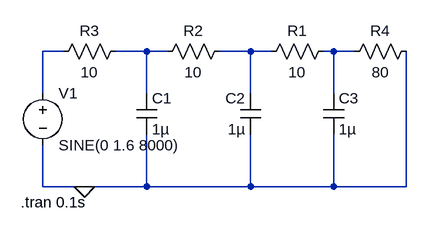
[diagram p0: schematic Draft2.asc]
Draft2.asc, the LTspice schematic file:
Version 4
SHEET 1 880 680
WIRE 16 64 -16 64
WIRE 144 64 96 64
WIRE 176 64 144 64
WIRE 304 64 256 64
WIRE 336 64 304 64
WIRE 432 64 416 64
WIRE 464 64 432 64
WIRE -16 128 -16 64
WIRE 144 128 144 64
WIRE 304 128 304 64
WIRE 432 128 432 64
WIRE -16 272 -16 208
WIRE 48 272 -16 272
WIRE 144 272 144 192
WIRE 144 272 48 272
WIRE 304 272 304 192
WIRE 304 272 144 272
WIRE 432 272 432 192
WIRE 432 272 304 272
WIRE 544 272 544 64
WIRE 544 272 432 272
FLAG 48 272 0
SYMBOL voltage -16 112 R0
WINDOW 123 0 0 Left 0
WINDOW 39 0 0 Left 0
SYMATTR InstName V1
SYMATTR Value SINE(0 1.6 8000)
SYMBOL cap 128 128 R0
SYMATTR InstName C1
SYMATTR Value 1µ
SYMBOL cap 320 192 R180
WINDOW 0 24 56 Left 2
WINDOW 3 24 8 Left 2
SYMATTR InstName C2
SYMATTR Value 1µ
SYMBOL res 272 48 R90
WINDOW 0 0 56 VBottom 2
WINDOW 3 32 56 VTop 2
SYMATTR InstName R2
SYMATTR Value 10
SYMBOL cap 416 128 R0
SYMATTR InstName C3
SYMATTR Value 1µ
SYMBOL res 560 48 R90
WINDOW 0 0 56 VBottom 2
WINDOW 3 32 56 VTop 2
SYMATTR InstName R4
SYMATTR Value 80
SYMBOL res 432 48 R90
WINDOW 0 0 56 VBottom 2
WINDOW 3 32 56 VTop 2
SYMATTR InstName R1
SYMATTR Value 10
SYMBOL res 112 48 R90
WINDOW 0 0 56 VBottom 2
WINDOW 3 32 56 VTop 2
SYMATTR InstName R3
SYMATTR Value 10
TEXT -50 296 Left 2 !.tran 0.1s

The netlist it stands for:
* Draft2.asc
V1 N001 0 SINE(0 1.6 8000)
C1 N002 0 1µ
C2 0 N003 1µ
R2 N003 N002 10
C3 N004 0 1µ
R4 0 N004 80
R1 N004 N003 10
R3 N002 N001 10
.tran 0.1s
.backanno
.end